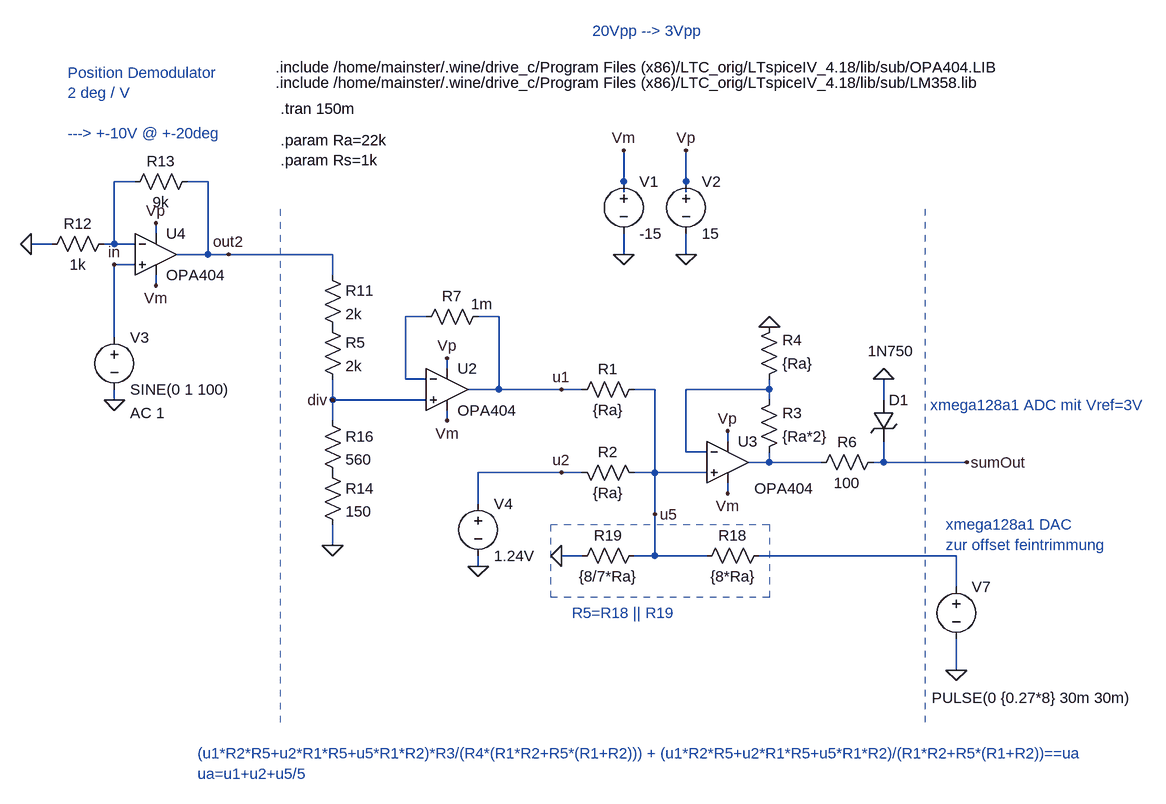
[diagram p0: schematic levelconv_ADC_DAC.asc]
levelconv_ADC_DAC.asc, the LTspice schematic file:
Version 4
SHEET 1 3540 3204
WIRE 1184 960 1152 960
WIRE 1296 960 1264 960
WIRE 1936 960 1936 912
WIRE 2032 960 2032 912
WIRE 1936 976 1936 960
WIRE 2032 976 2032 960
WIRE 1216 1040 1216 1024
WIRE 1056 1056 1024 1056
WIRE 1152 1056 1152 960
WIRE 1152 1056 1136 1056
WIRE 1184 1056 1152 1056
WIRE 1296 1072 1296 960
WIRE 1296 1072 1248 1072
WIRE 1328 1072 1296 1072
WIRE 1488 1072 1328 1072
WIRE 1936 1072 1936 1040
WIRE 2032 1072 2032 1040
WIRE 1184 1088 1152 1088
WIRE 1488 1104 1488 1072
WIRE 1216 1120 1216 1104
WIRE 1632 1168 1600 1168
WIRE 1744 1168 1712 1168
WIRE 1152 1200 1152 1088
WIRE 1664 1248 1664 1232
WIRE 1600 1264 1600 1168
WIRE 1632 1264 1600 1264
WIRE 1744 1280 1744 1168
WIRE 1744 1280 1696 1280
WIRE 1840 1280 1744 1280
WIRE 1872 1280 1840 1280
WIRE 1984 1280 1952 1280
WIRE 2160 1280 2160 1264
WIRE 2160 1280 2032 1280
WIRE 1152 1296 1152 1280
WIRE 1488 1296 1488 1264
WIRE 1632 1296 1488 1296
WIRE 2160 1296 2160 1280
WIRE 2336 1296 2336 1264
WIRE 1488 1328 1488 1296
WIRE 1664 1328 1664 1312
WIRE 2096 1360 2096 1344
WIRE 2032 1376 2032 1280
WIRE 2064 1376 2032 1376
WIRE 2160 1392 2160 1376
WIRE 2160 1392 2128 1392
WIRE 2240 1392 2160 1392
WIRE 2336 1392 2336 1360
WIRE 2336 1392 2320 1392
WIRE 2464 1392 2336 1392
WIRE 1840 1408 1712 1408
WIRE 1872 1408 1840 1408
WIRE 1984 1408 1984 1280
WIRE 1984 1408 1952 1408
WIRE 2064 1408 1984 1408
WIRE 2096 1440 2096 1424
WIRE 1712 1456 1712 1408
WIRE 1984 1472 1984 1408
WIRE 1488 1520 1488 1488
WIRE 1872 1536 1840 1536
WIRE 1984 1536 1984 1472
WIRE 1984 1536 1952 1536
WIRE 2064 1536 1984 1536
WIRE 2448 1536 2144 1536
WIRE 1712 1552 1712 1536
WIRE 2448 1584 2448 1536
WIRE 2448 1712 2448 1664
FLAG 2032 1072 0
FLAG 2032 912 Vp
FLAG 1936 1072 0
FLAG 1936 912 Vm
FLAG 1024 1056 0
FLAG 1152 1088 in
FLAG 1328 1072 out2
FLAG 1216 1024 Vp
FLAG 1216 1120 Vm
FLAG 1152 1296 0
FLAG 1488 1520 0
FLAG 1488 1296 div
FLAG 1664 1232 Vp
FLAG 1664 1328 Vm
FLAG 2096 1344 Vp
FLAG 2096 1440 Vm
FLAG 1712 1552 0
FLAG 2464 1392 sumOut
FLAG 2160 1184 0
FLAG 2448 1712 0
FLAG 1840 1536 0
FLAG 1840 1280 u1
FLAG 1840 1408 u2
FLAG 1984 1472 u5
FLAG 2336 1264 0
SYMBOL res 1280 944 R90
WINDOW 0 0 56 VBottom 0
WINDOW 3 32 56 VTop 0
SYMATTR InstName R13
SYMATTR Value 9k
SYMBOL res 1040 1072 R270
WINDOW 0 32 56 VTop 0
WINDOW 3 0 56 VBottom 0
SYMATTR InstName R12
SYMATTR Value 1k
SYMBOL Opamps\\opamp2 1216 1008 R0
SYMATTR InstName U4
SYMATTR Value OPA404
SYMBOL voltage 1936 944 R0
WINDOW 123 0 0 Left 0
WINDOW 39 0 0 Left 0
SYMATTR InstName V1
SYMATTR Value -15
SYMBOL voltage 2032 944 R0
WINDOW 123 0 0 Left 0
WINDOW 39 0 0 Left 0
SYMATTR InstName V2
SYMATTR Value 15
SYMBOL voltage 1152 1184 R0
WINDOW 123 24 132 Left 0
WINDOW 39 0 0 Left 0
SYMATTR InstName V3
SYMATTR Value SINE(0 1 100)
SYMATTR Value2 AC 1
SYMBOL res 1472 1088 R0
SYMATTR InstName R11
SYMATTR Value 2k
SYMBOL res 1472 1392 R0
SYMATTR InstName R14
SYMATTR Value 150
SYMBOL res 1472 1168 R0
SYMATTR InstName R5
SYMATTR Value 2k
SYMBOL res 1472 1312 R0
SYMATTR InstName R16
SYMATTR Value 560
SYMBOL res 1728 1152 R90
WINDOW 0 0 56 VBottom 0
WINDOW 3 -19 10 VTop 0
SYMATTR InstName R7
SYMATTR Value 1m
SYMBOL Opamps\\opamp2 1664 1216 R0
SYMATTR InstName U2
SYMATTR Value OPA404
SYMBOL res 2144 1392 M180
WINDOW 0 36 76 Left 0
WINDOW 3 36 40 Left 0
SYMATTR InstName R3
SYMATTR Value {Ra*2}
SYMBOL Opamps\\opamp2 2096 1328 R0
WINDOW 3 41 104 Left 0
SYMATTR InstName U3
SYMATTR Value OPA404
SYMBOL res 2144 1280 M180
WINDOW 0 36 76 Left 0
WINDOW 3 36 40 Left 0
SYMATTR InstName R4
SYMATTR Value {Ra}
SYMBOL res 1968 1424 M270
WINDOW 0 32 56 VTop 0
WINDOW 3 0 56 VBottom 0
SYMATTR InstName R2
SYMATTR Value {Ra}
SYMBOL res 1968 1264 R90
WINDOW 0 0 56 VBottom 0
WINDOW 3 32 56 VTop 0
SYMATTR InstName R1
SYMATTR Value {Ra}
SYMBOL voltage 1712 1440 R0
WINDOW 123 0 0 Left 0
WINDOW 39 0 0 Left 0
SYMATTR InstName V4
SYMATTR Value 1.24V
SYMBOL voltage 2448 1568 R0
WINDOW 3 -38 187 Left 0
WINDOW 123 0 0 Left 0
WINDOW 39 0 0 Left 0
SYMATTR InstName V7
SYMATTR Value PULSE(0 {0.27*8} 30m 30m)
SYMBOL res 2160 1520 R90
WINDOW 0 0 56 VBottom 0
WINDOW 3 32 56 VTop 0
SYMATTR InstName R18
SYMATTR Value {8*Ra}
SYMBOL res 1968 1520 R90
WINDOW 0 0 56 VBottom 0
WINDOW 3 32 56 VTop 0
SYMATTR InstName R19
SYMATTR Value {8/7*Ra}
SYMBOL res 2336 1376 R90
WINDOW 0 0 56 VBottom 0
WINDOW 3 32 56 VTop 0
SYMATTR InstName R6
SYMATTR Value 100
SYMBOL zener 2320 1296 R0
WINDOW 3 -8 -75 Left 0
SYMATTR InstName D1
SYMATTR Value 1N750
SYMATTR Description Diode
SYMATTR Type diode
TEXT 1408 848 Left 0 !.tran 150m
TEXT 1400 784 Left 0 !.include /home/mainster/.wine/drive_c/Program Files (x86)/LTC_orig/LTspiceIV_4.18/lib/sub/OPA404.LIB
TEXT 1400 808 Left 0 !.include /home/mainster/.wine/drive_c/Program Files (x86)/LTC_orig/LTspiceIV_4.18/lib/sub/LM358.lib
TEXT 1080 792 Left 0 ;Position Demodulator\n2 deg / V\n \n---> +-10V @ +-20deg
TEXT 2408 1304 Left 0 ;xmega128a1 ADC mit Vref=3V
TEXT 1888 728 Left 0 ;20Vpp --> 3Vpp
TEXT 2432 1488 Left 0 ;xmega128a1 DAC \nzur offset feintrimmung
TEXT 1408 896 Left 0 !.param Ra=22k\n.param Rs=1k
TEXT 1280 1840 Left 0 ;(u1*R2*R5+u2*R1*R5+u5*R1*R2)*R3/(R4*(R1*R2+R5*(R1+R2))) + (u1*R2*R5+u2*R1*R5+u5*R1*R2)/(R1*R2+R5*(R1+R2))==ua\nua=u1+u2+u5/5
TEXT 1856 1624 Left 0 ;R5=R18 || R19
LINE Normal 2400 1792 2400 992 2
LINE Normal 1408 1792 1408 992 2
RECTANGLE Normal 2160 1600 1824 1488 2

The netlist it stands for:
* levelconv_ADC_DAC.asc
R13 out2 N001 9k
R12 0 N001 1k
XU4 in N001 Vp Vm out2 OPA404  ; pins In+ In- V+ V- OUT
V1 Vm 0 -15
V2 Vp 0 15
V3 in 0 SINE(0 1 100) AC 1
R11 out2 P001 2k
R14 P002 0 150
R5 P001 div 2k
R16 div P002 560
R7 u1 N002 1m
XU2 div N002 Vp Vm u1 OPA404  ; pins In+ In- V+ V- OUT
R3 N004 N003 {Ra*2}
XU3 u5 N003 Vp Vm N004 OPA404  ; pins In+ In- V+ V- OUT
R4 N003 0 {Ra}
R2 u5 u2 {Ra}
R1 u5 u1 {Ra}
V4 u2 0 1.24V
V7 N005 0 PULSE(0 {0.27*8} 30m 30m)
R18 N005 u5 {8*Ra}
R19 u5 0 {8/7*Ra}
R6 sumOut N004 100
D1 0 sumOut 1N750
.model D D
.lib standard.dio
.tran 150m
.include /home/mainster/.wine/drive_c/Program Files (x86)/LTC_orig/LTspiceIV_4.18/lib/sub/OPA404.LIB
.include /home/mainster/.wine/drive_c/Program Files (x86)/LTC_orig/LTspiceIV_4.18/lib/sub/LM358.lib
* Position Demodulator
* 2 deg / V
* ---> +-10V @ +-20deg
* xmega128a1 ADC mit Vref=3V
* 20Vpp --> 3Vpp
* xmega128a1 DAC
* zur offset feintrimmung
.param Ra=22k
.param Rs=1k
* (u1*R2*R5+u2*R1*R5+u5*R1*R2)*R3/(R4*(R1*R2+R5*(R1+R2))) + (u1*R2*R5+u2*R1*R5+u5*R1*R2)/(R1*R2+R5*(R1+R2))==ua
* ua=u1+u2+u5/5
* R5=R18 || R19
.backanno
.end